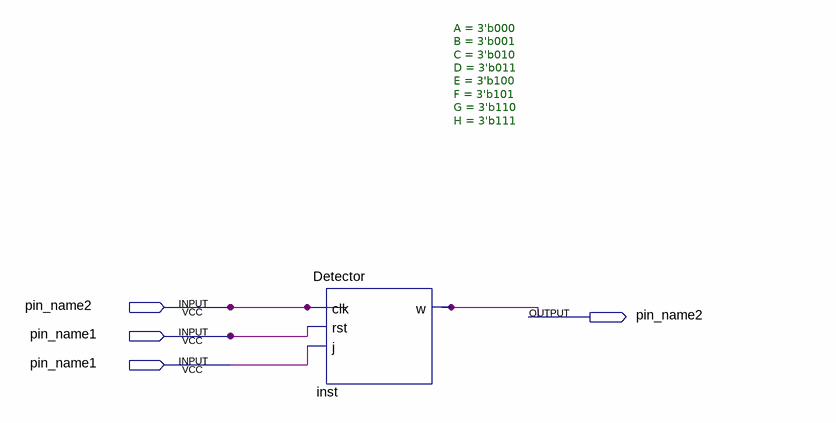
[diagram p0: schematic sheet]
// Quartus schematic BlockDetectora.bdf as structural Verilog: 1 symbols, 4 pins
module BlockDetectora (
  inout  pin_name2,
  input  pin_name1
);

  wire inst_w;

  Detector #(.A(3'b000), .B(3'b001), .C(3'b010), .D(3'b011), .E(3'b100), .F(3'b101), .G(3'b110), .H(3'b111)) inst (
    .clk(pin_name2), .rst(pin_name1), .j(pin_name1), .w(inst_w));
endmodule
